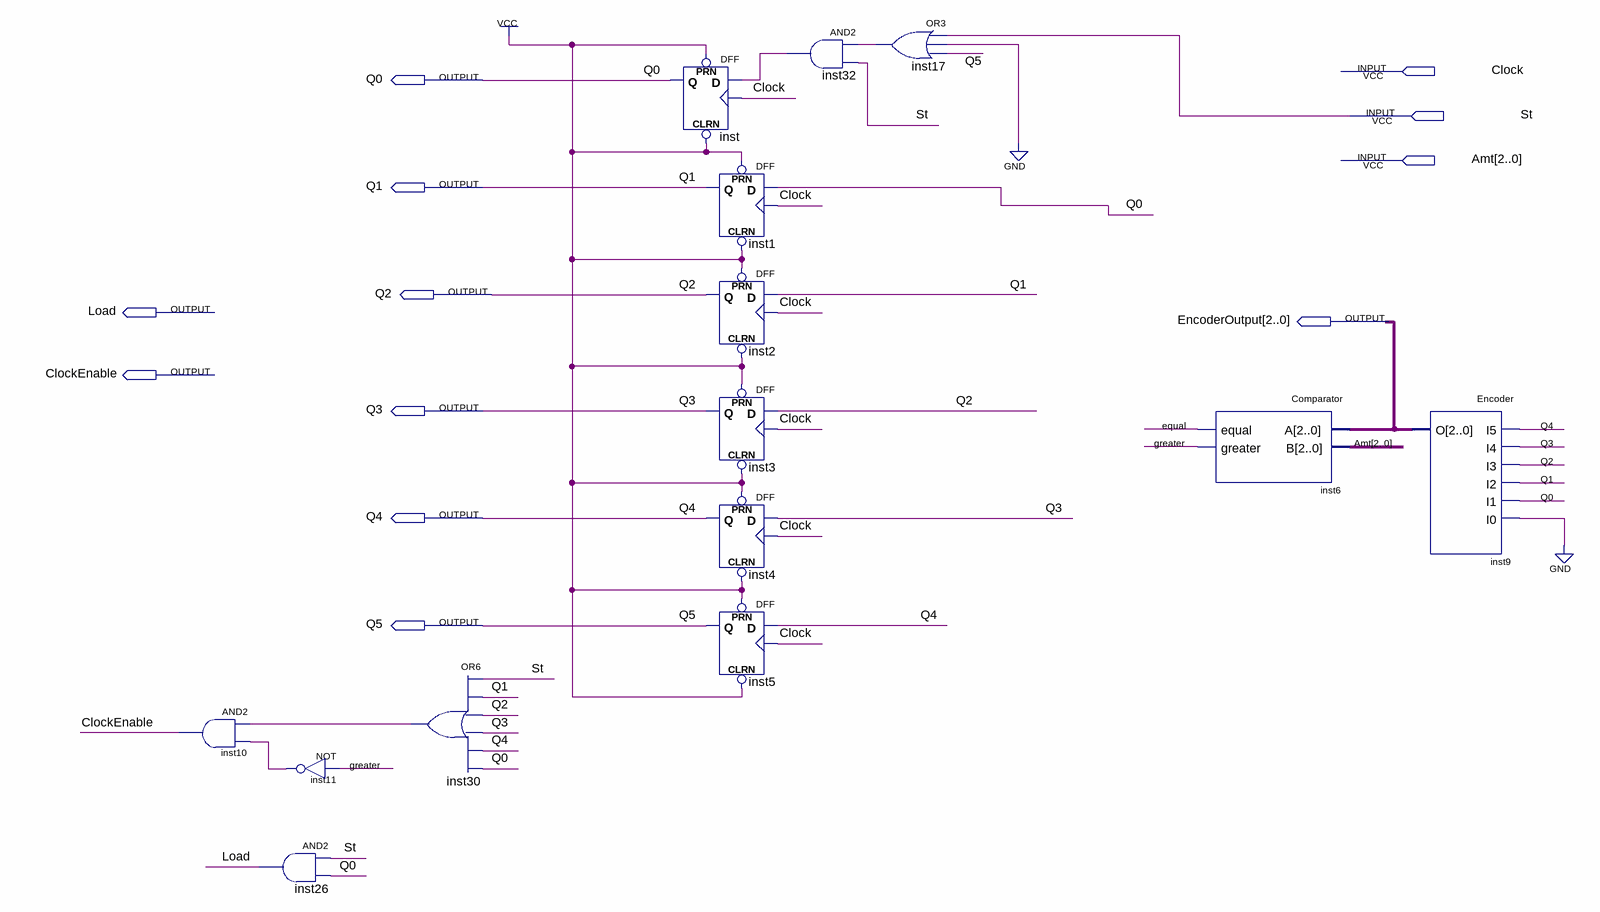
[diagram p0: schematic sheet]
// Quartus schematic Control2.bdf as structural Verilog: 14 symbols, 12 pins
module Control2 (
  input  Clock,
  input  St,
  input  [2:0] Amt,
  output Q0,
  output Q1,
  output Q2,
  output Load,
  output [2:0] EncoderOutput,
  output ClockEnable,
  output Q3,
  output Q4,
  output Q5
);

  wire equal, greater, inst11_out, inst17_out, inst30_out, inst32_out;

  and inst10 (ClockEnable, inst30_out, inst11_out);
  and inst26 (Load, St, Q0);
  not inst11 (inst11_out, greater);
  or inst30 (inst30_out, St, Q1, Q2, Q3, Q4, Q0);
  DFF inst (.CLRN(1'b1), .CLK(Clock), .D(inst32_out), .PRN(1'b1), .Q(Q0));
  DFF inst1 (.CLRN(1'b1), .CLK(Clock), .D(Q0), .PRN(1'b1), .Q(Q1));
  DFF inst2 (.CLRN(1'b1), .CLK(Clock), .D(Q1), .PRN(1'b1), .Q(Q2));
  DFF inst3 (.CLRN(1'b1), .CLK(Clock), .D(Q2), .PRN(1'b1), .Q(Q3));
  DFF inst4 (.CLRN(1'b1), .CLK(Clock), .D(Q3), .PRN(1'b1), .Q(Q4));
  DFF inst5 (.CLRN(1'b1), .CLK(Clock), .D(Q4), .PRN(1'b1), .Q(Q5));
  and inst32 (inst32_out, inst17_out, St);
  or inst17 (inst17_out, St, 1'b0, Q5);
  Comparator inst6 (.A(EncoderOutput), .B(Amt), .equal(equal), .greater(greater));
  Encoder inst9 (.I5(Q4), .I4(Q3), .I3(Q2), .I2(Q1), .I1(Q0), .I0(1'b0), .O(EncoderOutput));
endmodule
